# Altium schematic sheet extensionboard.SchDoc
size A1
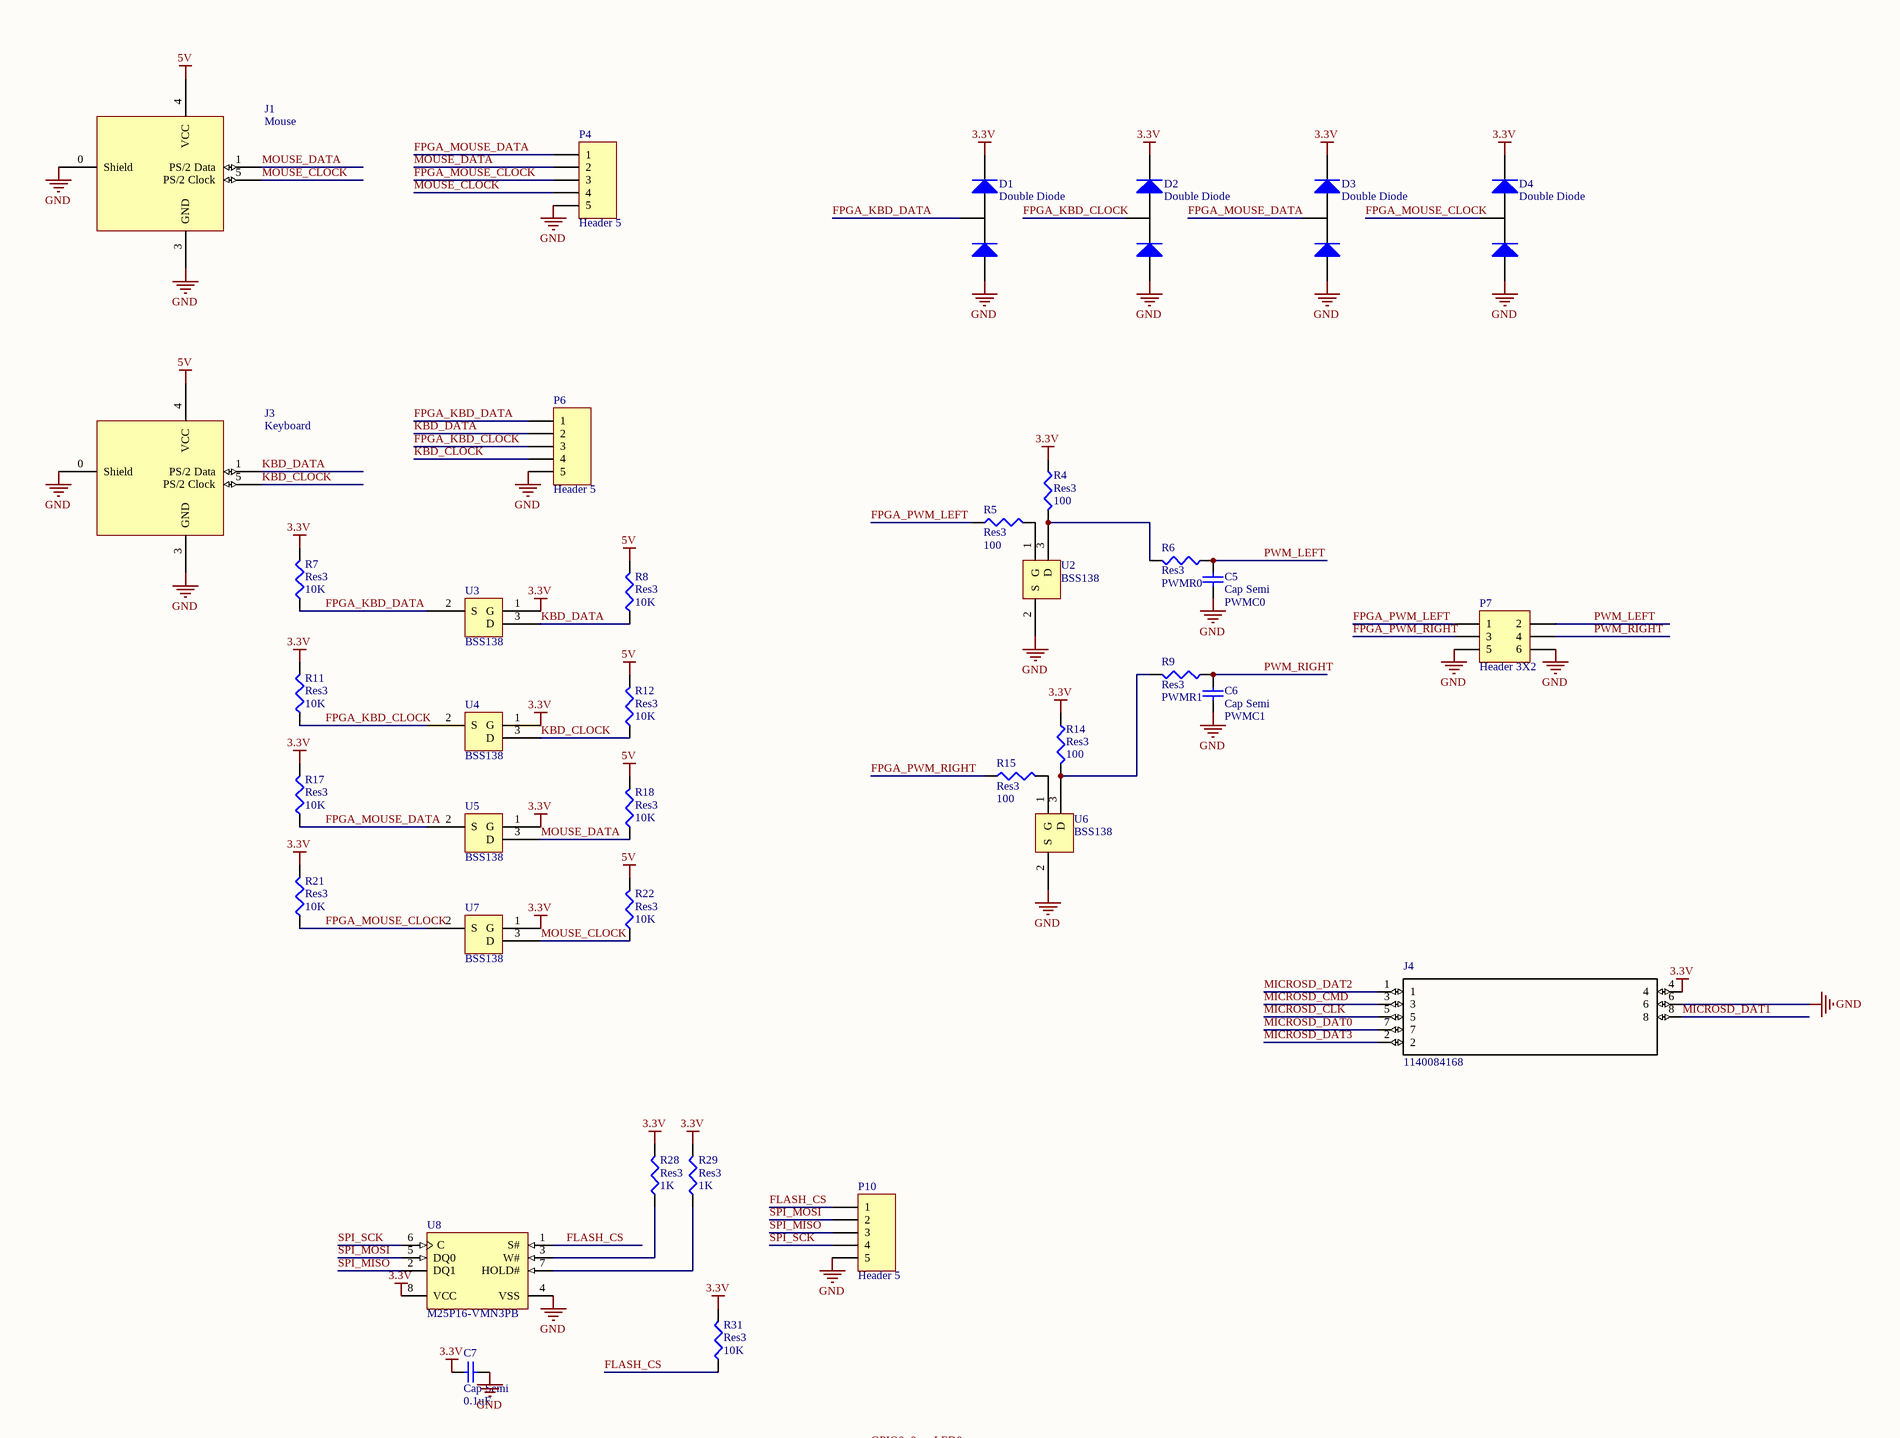
[diagram p0: extensionboard.SchDoc, top left]
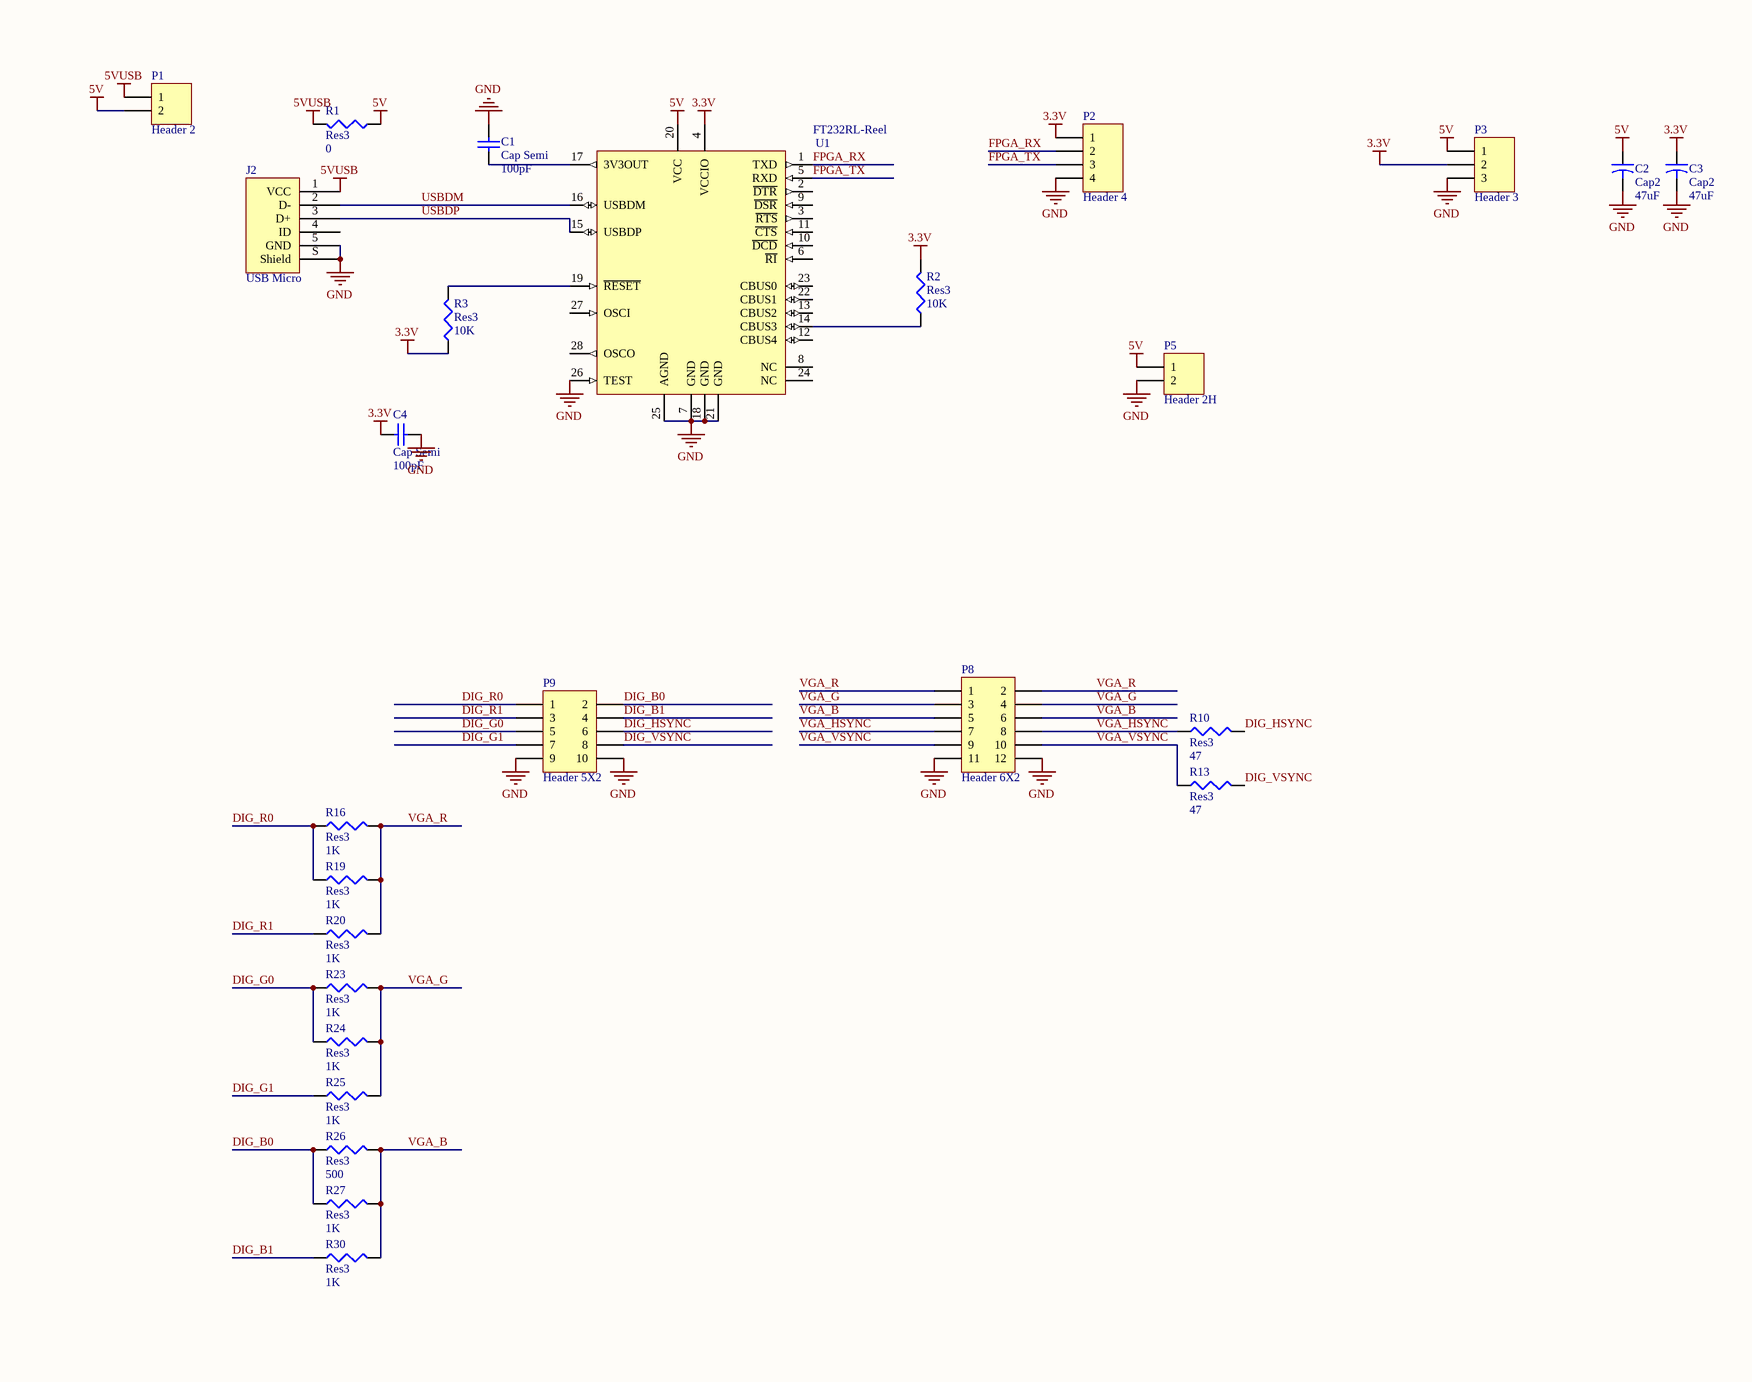
[diagram p1: extensionboard.SchDoc, top right]
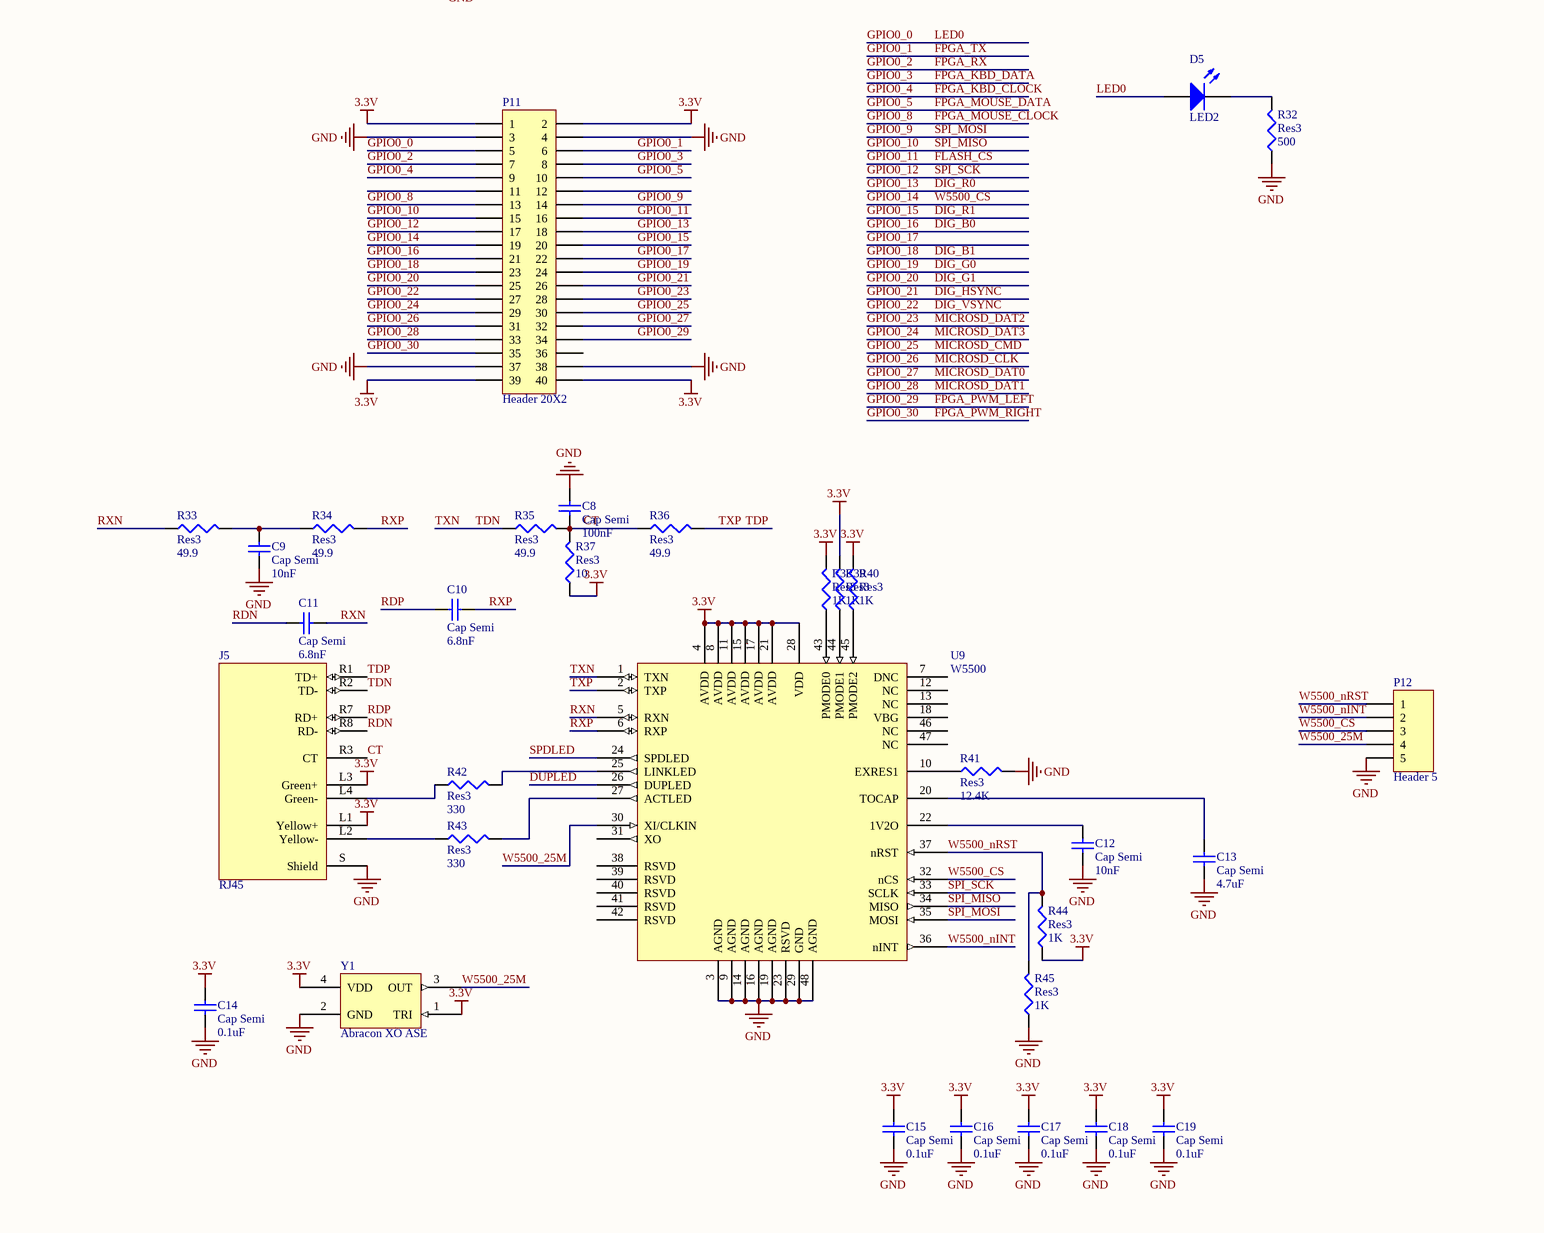
[diagram p2: extensionboard.SchDoc, bottom left]

## Parts
C1  Cap Semi  value 100pF  [1608[0603]]
C2  Cap2  value 47uF  [CAPR5-4X5]
C3  Cap2  value 47uF  [CAPR5-4X5]
C4  Cap Semi  value 100pF  [1608[0603]]
C5  Cap Semi  value PWMC0  [C1210]
C6  Cap Semi  value PWMC1  [C1210]
C7  Cap Semi  value 0.1uF  [1608[0603]]
C8  Cap Semi  value 100nF  [1608[0603]]
C9  Cap Semi  value 10nF  [1608[0603]]
C10  Cap Semi  value 6.8nF  [1608[0603]]
C11  Cap Semi  value 6.8nF  [1608[0603]]
C12  Cap Semi  value 10nF  [1608[0603]]
C13  Cap Semi  value 4.7uF  [1608[0603]]
C14  Cap Semi  value 0.1uF  [1608[0603]]
C15  Cap Semi  value 0.1uF  [1608[0603]]
C16  Cap Semi  value 0.1uF  [1608[0603]]
C17  Cap Semi  value 0.1uF  [1608[0603]]
C18  Cap Semi  value 0.1uF  [1608[0603]]
C19  Cap Semi  value 0.1uF  [1608[0603]]
D1  Double Diode  [SOT-23]
D2  Double Diode  [SOT-23]
D3  Double Diode  [SOT-23]
D4  Double Diode  [SOT-23]
D5  LED2  [3.2X1.6X1.1]
J1  Mouse  [MD-60S]
J2  USB Micro  [FCI USB 10118193-0001LF]
J3  Keyboard  [MD-60S]
J4  1140084168  [1140084168]
J5  RJ45  [RB1-125BAG1A]
P1  Header 2  [HDR1X2]
P2  Header 4  [HDR1X4]
P3  Header 3  [HDR1X3]
P4  Header 5  [HDR1X5]
P5  Header 2H  [HDR1X2H]
P6  Header 5  [HDR1X5]
P7  Header 3X2  [HDR2X3]
P8  Header 6X2  [HDR2X6]
P9  Header 5X2  [HDR2X5]
P10  Header 5  [HDR1X5]
P11  Header 20X2  [HDR2X20]
P12  Header 5  [HDR1X5]
R1  Res3  value 0  [14-1210]
R2  Res3  value 10K  [J1-0603]
R3  Res3  value 10K  [J1-0603]
R4  Res3  value 100  [14-1210]
R5  Res3  value 100  [14-1210]
R6  Res3  value PWMR0  [14-1210]
R7  Res3  value 10K  [J1-0603]
R8  Res3  value 10K  [J1-0603]
R9  Res3  value PWMR1  [14-1210]
R10  Res3  value 47  [J1-0603]
R11  Res3  value 10K  [J1-0603]
R12  Res3  value 10K  [J1-0603]
R13  Res3  value 47  [J1-0603]
R14  Res3  value 100  [14-1210]
R15  Res3  value 100  [14-1210]
R16  Res3  value 1K  [J1-0603]
R17  Res3  value 10K  [J1-0603]
R18  Res3  value 10K  [J1-0603]
R19  Res3  value 1K  [J1-0603]
R20  Res3  value 1K  [J1-0603]
R21  Res3  value 10K  [J1-0603]
R22  Res3  value 10K  [J1-0603]
R23  Res3  value 1K  [J1-0603]
R24  Res3  value 1K  [J1-0603]
R25  Res3  value 1K  [J1-0603]
R26  Res3  value 500  [J1-0603]
R27  Res3  value 1K  [J1-0603]
R28  Res3  value 1K  [J1-0603]
R29  Res3  value 1K  [J1-0603]
R30  Res3  value 1K  [J1-0603]
R31  Res3  value 10K  [J1-0603]
R32  Res3  value 500  [J1-0603]
R33  Res3  value 49.9  [J1-0603]
R34  Res3  value 49.9  [J1-0603]
R35  Res3  value 49.9  [J1-0603]
R36  Res3  value 49.9  [J1-0603]
R37  Res3  value 10  [J1-0603]
R38  Res3  value 1K  [J1-0603]
R39  Res3  value 1K  [J1-0603]
R40  Res3  value 1K  [J1-0603]
R41  Res3  value 12.4K  [J1-0603]
R42  Res3  value 330  [J1-0603]
R43  Res3  value 330  [J1-0603]
R44  Res3  value 1K  [J1-0603]
R45  Res3  value 1K  [J1-0603]
U1  FT232RL-Reel  [SSOP-28_N]
U2  BSS138  [SOT-23]
U3  BSS138  [SOT-23]
U4  BSS138  [SOT-23]
U5  BSS138  [SOT-23]
U6  BSS138  [SOT-23]
U7  BSS138  [SOT-23]
U8  M25P16-VMN3PB  [MICT-MN-8_N]
U9  W5500  [LQFP-48]
Y1  Abracon XO ASE  [ABRACON ASE]

## Nets
3.3V: C3.1 C4.1 C7.1 C14.2 C15.2 C16.2 C17.2 C18.2 C19.2 D1.2 D2.2 D3.2 D4.2 J4.4 J5.L1(Yellow+) J5.L3(Green+) P2.1 P3.2 P11.1 P11.2 P11.39 P11.40 R2.2 R3.1 R4.1 R7.2 R11.2 R14.1 R17.2 R21.2 R28.2 R29.2 R31.2 R37.1 R38.2 R39.2 R40.2 R44.1 U1.4(VCCIO) U3.1(G) U4.1(G) U5.1(G) U7.1(G) U8.8(VCC) U9.4(AVDD) U9.8(AVDD) U9.11(AVDD) U9.15(AVDD) U9.17(AVDD) U9.21(AVDD) U9.28(VDD) Y1.1(TRI) Y1.4(VDD)
5V: C2.1 J1.4(VCC) J3.4(VCC) P1.2 P3.1 P5.1 R1.1 R8.2 R12.2 R18.2 R22.2 U1.20(VCC)
5VUSB: J2.1(VCC) P1.1 R1.2
GND: C1.2 C2.2 C3.2 C4.2 C5.1 C6.1 C7.2 C8.1 C9.2 C12.1 C13.1 C14.1 C15.1 C16.1 C17.1 C18.1 C19.1 D1.1 D2.1 D3.1 D4.1 J1.0(Shield) J1.3(GND) J2.5(GND) J2.S(Shield) J3.0(Shield) J3.3(GND) J4.6 J5.S(Shield) P2.4 P3.3 P4.5 P5.2 P6.5 P7.5 P7.6 P8.11 P8.12 P9.9 P9.10 P10.5 P11.3 P11.4 P11.37 P11.38 P12.5 R32.1 R41.2 R45.1 U1.7(GND) U1.18(GND) U1.21(GND) U1.25(AGND) U1.26(TEST) U2.2(S) U6.2(S) U8.4(VSS) U9.3(AGND) U9.9(AGND) U9.14(AGND) U9.16(AGND) U9.19(AGND) U9.23(RSVD) U9.29(GND) U9.48(AGND) Y1.2(GND)
CT: C8.2 J5.R3(CT) R35.2 R36.1 R37.2
DIG_B0: P9.2 P11.21 R26.1 R27.1  [also labelled GPIO0_16]
DIG_B1: P9.4 P11.23 R30.1  [also labelled GPIO0_18]
DIG_G0: P9.5 P11.24 R23.1 R24.1  [also labelled GPIO0_19]
DIG_G1: P9.7 P11.25 R25.1  [also labelled GPIO0_20]
DIG_HSYNC: P9.6 P11.26 R10.2  [also labelled GPIO0_21]
DIG_R0: P9.1 P11.18 R16.1 R19.1  [also labelled GPIO0_13]
DIG_R1: P9.3 P11.20 R20.1  [also labelled GPIO0_15]
DIG_VSYNC: P9.8 P11.27 R13.2  [also labelled GPIO0_22]
DUPLED: U9.26(DUPLED)
FLASH_CS: P10.1 P11.16 R31.1 U8.1(S#)  [also labelled GPIO0_11]
FPGA_KBD_CLOCK: D2.3 P6.3 P11.9 R11.1 U4.2(S)  [also labelled GPIO0_4]
FPGA_KBD_DATA: D1.3 P6.1 P11.8 R7.1 U3.2(S)  [also labelled GPIO0_3]
FPGA_MOUSE_CLOCK: D4.3 P4.3 P11.13 R21.1 U7.2(S)  [also labelled GPIO0_8]
FPGA_MOUSE_DATA: D3.3 P4.1 P11.10 R17.1 U5.2(S)  [also labelled GPIO0_5]
FPGA_PWM_LEFT: P7.1 P11.34 R5.1  [also labelled GPIO0_29]
FPGA_PWM_RIGHT: P7.3 P11.35 R15.1  [also labelled GPIO0_30]
FPGA_RX: P2.2 P11.7 U1.1(TXD)  [also labelled GPIO0_2]
FPGA_TX: P2.3 P11.6 U1.5(RXD)  [also labelled GPIO0_1]
GPIO0_0: D5.1(A) P11.5  [also labelled LED0]
GPIO0_9: P10.2 P11.14 U8.5(DQ0) U9.35(MOSI)  [also labelled SPI_MOSI]
GPIO0_10: P10.3 P11.15 U8.2(DQ1) U9.34(MISO)  [also labelled SPI_MISO]
GPIO0_12: P10.4 P11.17 U8.6(C) U9.33(SCLK)  [also labelled SPI_SCK]
GPIO0_14: P11.19 P12.3 U9.32(nCS)  [also labelled W5500_CS]
GPIO0_17: P11.22
GPIO0_23: J4.1 P11.28  [also labelled MICROSD_DAT2]
GPIO0_24: J4.2 P11.29  [also labelled MICROSD_DAT3]
GPIO0_25: J4.3 P11.30  [also labelled MICROSD_CMD]
GPIO0_26: J4.5 P11.31  [also labelled MICROSD_CLK]
GPIO0_27: J4.7 P11.32  [also labelled MICROSD_DAT0]
GPIO0_28: J4.8 P11.33  [also labelled MICROSD_DAT1]
KBD_CLOCK: J3.5(PS/2_Clock) P6.4 R12.1 U4.3(D)
KBD_DATA: J3.1(PS/2_Data) P6.2 R8.1 U3.3(D)
MOUSE_CLOCK: J1.5(PS/2_Clock) P4.4 R22.1 U7.3(D)
MOUSE_DATA: J1.1(PS/2_Data) P4.2 R18.1 U5.3(D)
PWM_LEFT: C5.2 P7.2 R6.1
PWM_RIGHT: C6.2 P7.4 R9.1
RDN: C11.1 J5.R8(RD-)
RDP: C10.1 J5.R7(RD+)
RXN: C11.2 R33.1 U9.5(RXN)
RXP: C10.2 R34.2 U9.6(RXP)
SPDLED: U9.24(SPDLED)
TDN: J5.R2(TD-) R35.1 U9.1(TXN)  [also labelled TXN]
TDP: J5.R1(TD+) R36.2 U9.2(TXP)  [also labelled TXP]
USBDM: J2.2(D-) U1.16(USBDM)
USBDP: J2.3(D+) U1.15(USBDP)
VGA_B: P8.5 P8.6 R26.2 R27.2 R30.2
VGA_G: P8.3 P8.4 R23.2 R24.2 R25.2
VGA_HSYNC: P8.7 P8.8 R10.1
VGA_R: P8.1 P8.2 R16.2 R19.2 R20.2
VGA_VSYNC: P8.9 P8.10 R13.1
W5500_25M: P12.4 U9.30(XI/CLKIN) Y1.3(OUT)
W5500_nINT: P12.2 U9.36(nINT)
W5500_nRST: P12.1 R44.2 R45.2 U9.37(nRST)
NetC1_1: C1.1 U1.17(3V3OUT)
NetC9_1: C9.1 R33.2 R34.1
NetC12_2: C12.2 U9.22(1V2O)
NetC13_2: C13.2 U9.20(TOCAP)
NetD5_2: D5.2(K) R32.2
NetJ5_L2: J5.L2(Yellow-) R43.1
NetJ5_L4: J5.L4(Green-) R42.1
NetR2_1: R2.1 U1.14(CBUS3)
NetR3_2: R3.2 U1.19(~{RESET})
NetR4_2: R4.2 R6.2 U2.3(D)
NetR5_2: R5.2 U2.1(G)
NetR9_2: R9.2 R14.2 U6.3(D)
NetR15_2: R15.2 U6.1(G)
NetR28_1: R28.1 U8.3(W#)
NetR29_1: R29.1 U8.7(HOLD#)
NetR38_1: R38.1 U9.43(PMODE0)
NetR39_1: R39.1 U9.44(PMODE1)
NetR40_1: R40.1 U9.45(PMODE2)
NetR41_1: R41.1 U9.10(EXRES1)
NetR42_2: R42.2 U9.25(LINKLED)
NetR43_2: R43.2 U9.27(ACTLED)

Not connected (* = marked no-connect by the designer): J2 4(ID); P11 11 12 36; U1 2(~{DTR}) 3(~{RTS}) 6(~{RI}) 8(NC) 9(~{DSR}) 10(~{DCD}) 11(~{CTS}) 12(CBUS4) 13(CBUS2) 22(CBUS1) 23(CBUS0) 24(NC) 27(OSCI) 28(OSCO); U9 7(DNC) 12(NC) 13(NC) 18(VBG) 31(XO) 38(RSVD) 39(RSVD) 40(RSVD) 41(RSVD) 42(RSVD) 46(NC) 47(NC)

## Library data of the parts
C1 C4-C19 = Cap Semi: Capacitor (Semiconductor SIM Model); Published: 8-Jun-2000; LatestRevisionDate: 29-May-2009; LatestRevisionNote: IPC-7351 Footprint Added.; PackageReference: C1206; Publisher: Altium Limited; PackageDescription: Chip Capacitor
C2 C3 = Cap2: Capacitor; Published: 23-Sep-2002; PackageReference: CAPR5-4X5; Publisher: Altium Limited; PackageDescription: Capacitor; 2 Leads
D1-D4 = BAT54S
D5 = LED2: Typical RED, GREEN, YELLOW, AMBER GaAs LED; Published: 8-Jun-2000; LatestRevisionDate: 17-Jul-2002; LatestRevisionNote: Re-released for DXP Platform.; PackageVersion: Feb-2002; PackageReference: 3.2X1.6X1.1; Publisher: Altium Limited; PackageDescription: SM LED; 2 Flat Leads
J1 J3 = MD60S
J2 = USB 2.0 Type B Micro
J4 = 1140084168: Memory Card Connector, Microsd, 8 Position, Full Reel; MF: Amphenol ICC; MP: 114-00841-68; Digi-Key_Part_Number: 114-00841-68-1-ND; Package: None; Digi-Key_Purchase_URL: https://www.digikey.com/product-detail/en/amphenol-icc-commercial-products/114-00841-68/114-00841-68-1-ND/2187101?utm_source=snapeda&utm_medium=aggregator&utm_campaign=symbol; SnapEDA_Link: https://www.snapeda.com/parts/114-00841-68/Amphenol%20ICC/view-part/?ref=snap; Value: *
P1 = Header 2: Header, 2-Pin; LatestRevisionDate: 17-Jul-2002; LatestRevisionNote: Re-released for DXP Platform.; Publisher: Altium Limited
P2 = Header 4: Header, 4-Pin; LatestRevisionDate: 17-Jul-2002; LatestRevisionNote: Re-released for DXP Platform.; Publisher: Altium Limited
P3 = Header 3: Header, 3-Pin; LatestRevisionDate: 17-Jul-2002; LatestRevisionNote: Re-released for DXP Platform.; Publisher: Altium Limited
P4 P6 P10 P12 = Header 5: Header, 5-Pin; LatestRevisionDate: 17-Jul-2002; LatestRevisionNote: Re-released for DXP Platform.; Publisher: Altium Limited
P5 = Header 2H: Header, 2-Pin, Right Angle; LatestRevisionDate: 17-Jul-2002; LatestRevisionNote: Re-released for DXP Platform.; Publisher: Altium Limited
P7 = Header 3X2: Header, 3-Pin, Dual row; LatestRevisionDate: 17-Jul-2002; LatestRevisionNote: Re-released for DXP Platform.; Publisher: Altium Limited
P8 = Header 6X2: Header, 6-Pin, Dual row; LatestRevisionDate: 17-Jul-2002; LatestRevisionNote: Re-released for DXP Platform.; Publisher: Altium Limited
P9 = Header 5X2: Header, 5-Pin, Dual row; LatestRevisionDate: 17-Jul-2002; LatestRevisionNote: Re-released for DXP Platform.; Publisher: Altium Limited
P11 = Header 20X2: Header, 20-Pin, Dual row; LatestRevisionDate: 17-Jul-2002; LatestRevisionNote: Re-released for DXP Platform.; Publisher: Altium Limited
R1-R45 = Res3: Resistor; Published: 8-Jun-2000; LatestRevisionDate: 29-May-2009; LatestRevisionNote: IPC-7351 Footprint Added.; PackageReference: J1-0603; Publisher: Altium Limited; PackageDescription: Chip Resistor
U1 = FT232RL-Reel: USB UART Asynchronous Serial Data Transfer Chip, 28-pin SSOP, Tape and Reel; Manufacturer: FTDI; DatasheetVersion: ver 2.10, Mar-2012; PackageVersion: Mar-12; PackageReference: SSOP-28; PackageDescription: 28-Pin Small Outline Package 0.65 mm Pitch; PartNumber: FT232RL-Reel; ComponentLink1Description: Manufacturer URL; ComponentLink1URL: http://www.ftdichip.com/; ComponentLink2Description: Datasheet; ComponentLink2URL: http://www.ftdichip.com/Support/Documents/DataSheets/ICs/DS_FT232R.pdf
U2-U7 = BSS138: BSS138 SOT-23
U8 = M25P16-VMN3PB: 16 Mb (x1) Automotive Serial NOR Flash Memory, 75 MHz, 2.7 to 3.6 V, 8-pin SO8 Narrow (MN), Tube; Part Family: M25P; Manufacturer: Micron; Density: 16Mb; Speed: 75 MHz; Voltage: 2.7V-3.6V; DatasheetVersion: Rev. Y; PackageVersion: Rev 11; PackageReference: MICT-MN-8; PackageDescription: 8-Pin SO Narrow, 3.9 X 4.9 mm, Pitch 1.27 mm; Applications: Automotive; Package: SO8 Narrow; Part Status: Production; RoHS: Yes; Type: Data Storage; Width: x1; Mounting Technology: Surface Mount; PartNumber: M25P16-VMN3PB; ComponentLink1Description: Manufacturer URL; ComponentLink1URL: http://www.micron.com/; ComponentLink2Description: Datasheet; ComponentLink2URL: http://www.micron.com/~/media/Documents/Products/Data%20Sheet/NOR%20Flash/Serial%20NOR/M25P/M25P16.pdf; ComponentLink3Description: Package Specification; ComponentLink3URL: http://www.micron.com/~/media/Documents/Products/Data%20Sheet/NOR%20Flash/Serial%20NOR/M25P/M25P05A.pdf
U9 = W5500: W5500 LQFP-48
Y1 = Abracon XO ASE: SMD CMOS Crystal Oscillator